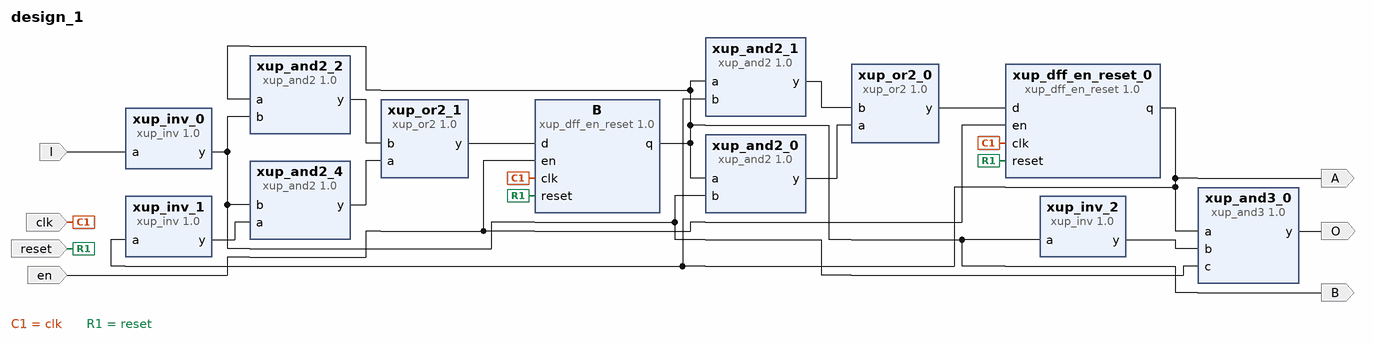
[diagram p0: block diagram of the top level]
# Vivado block design design_1, xc7a35tcpg236-1, Vivado 2023.1
create_bd_design design_1

create_bd_port -dir I I
create_bd_port -dir O O
create_bd_port -dir I clk
create_bd_port -dir O A
create_bd_port -dir O B
create_bd_port -dir I en
create_bd_port -dir I reset

create_bd_cell -type ip -vlnv xilinx.com:XUP:xup_and2:1.0 xup_and2_0
create_bd_cell -type ip -vlnv xilinx.com:XUP:xup_and2:1.0 xup_and2_1
create_bd_cell -type ip -vlnv xilinx.com:XUP:xup_or2:1.0 xup_or2_0
create_bd_cell -type ip -vlnv xilinx.com:XUP:xup_inv:1.0 xup_inv_0
create_bd_cell -type ip -vlnv xilinx.com:XUP:xup_and2:1.0 xup_and2_2
create_bd_cell -type ip -vlnv xilinx.com:XUP:xup_and2:1.0 xup_and2_4
create_bd_cell -type ip -vlnv xilinx.com:XUP:xup_inv:1.0 xup_inv_1
create_bd_cell -type ip -vlnv xilinx.com:XUP:xup_or2:1.0 xup_or2_1
create_bd_cell -type ip -vlnv xilinx.com:XUP:xup_inv:1.0 xup_inv_2
create_bd_cell -type ip -vlnv xilinx.com:XUP:xup_and3:1.0 xup_and3_0
create_bd_cell -type ip -vlnv xilinx.com:XUP:xup_dff_en_reset:1.0 B
set_property -dict {CONFIG.DELAY 0} [get_bd_cells B]
create_bd_cell -type ip -vlnv xilinx.com:XUP:xup_dff_en_reset:1.0 xup_dff_en_reset_0
set_property -dict {CONFIG.DELAY 0} [get_bd_cells xup_dff_en_reset_0]

# ---- connections ----

connect_bd_net -net A_q [get_bd_pins xup_dff_en_reset_0/q] \
  [get_bd_pins xup_and2_1/b] [get_bd_pins xup_inv_1/a] [get_bd_pins xup_and3_0/a] [get_bd_ports A]
connect_bd_net [get_bd_pins B/q] \
  [get_bd_pins xup_inv_2/a] [get_bd_pins xup_and2_2/a] [get_bd_pins xup_and2_1/a] [get_bd_pins xup_and2_0/a] [get_bd_ports B]
connect_bd_net [get_bd_ports I] [get_bd_pins xup_inv_0/a]
connect_bd_net [get_bd_ports clk] [get_bd_pins B/clk] [get_bd_pins xup_dff_en_reset_0/clk]
connect_bd_net [get_bd_ports en] [get_bd_pins xup_dff_en_reset_0/en] [get_bd_pins B/en]
connect_bd_net [get_bd_ports reset] [get_bd_pins xup_dff_en_reset_0/reset] [get_bd_pins B/reset]
connect_bd_net [get_bd_pins xup_and2_0/y] [get_bd_pins xup_or2_0/a]
connect_bd_net [get_bd_pins xup_and2_1/y] [get_bd_pins xup_or2_0/b]
connect_bd_net [get_bd_pins xup_and2_2/y] [get_bd_pins xup_or2_1/b]
connect_bd_net [get_bd_pins xup_and2_4/y] [get_bd_pins xup_or2_1/a]
connect_bd_net [get_bd_pins xup_and3_0/y] [get_bd_ports O]
connect_bd_net [get_bd_pins xup_inv_0/y] [get_bd_pins xup_and2_0/b] [get_bd_pins xup_and2_2/b] [get_bd_pins xup_and2_4/b] [get_bd_pins xup_and3_0/c]
connect_bd_net [get_bd_pins xup_inv_1/y] [get_bd_pins xup_and2_4/a]
connect_bd_net [get_bd_pins xup_inv_2/y] [get_bd_pins xup_and3_0/b]
connect_bd_net [get_bd_pins xup_or2_0/y] [get_bd_pins xup_dff_en_reset_0/d]
connect_bd_net [get_bd_pins xup_or2_1/y] [get_bd_pins B/d]

validate_bd_design
save_bd_design
